# EAGLE design tongue_electrode_grid (EAGLE 7.3.0)
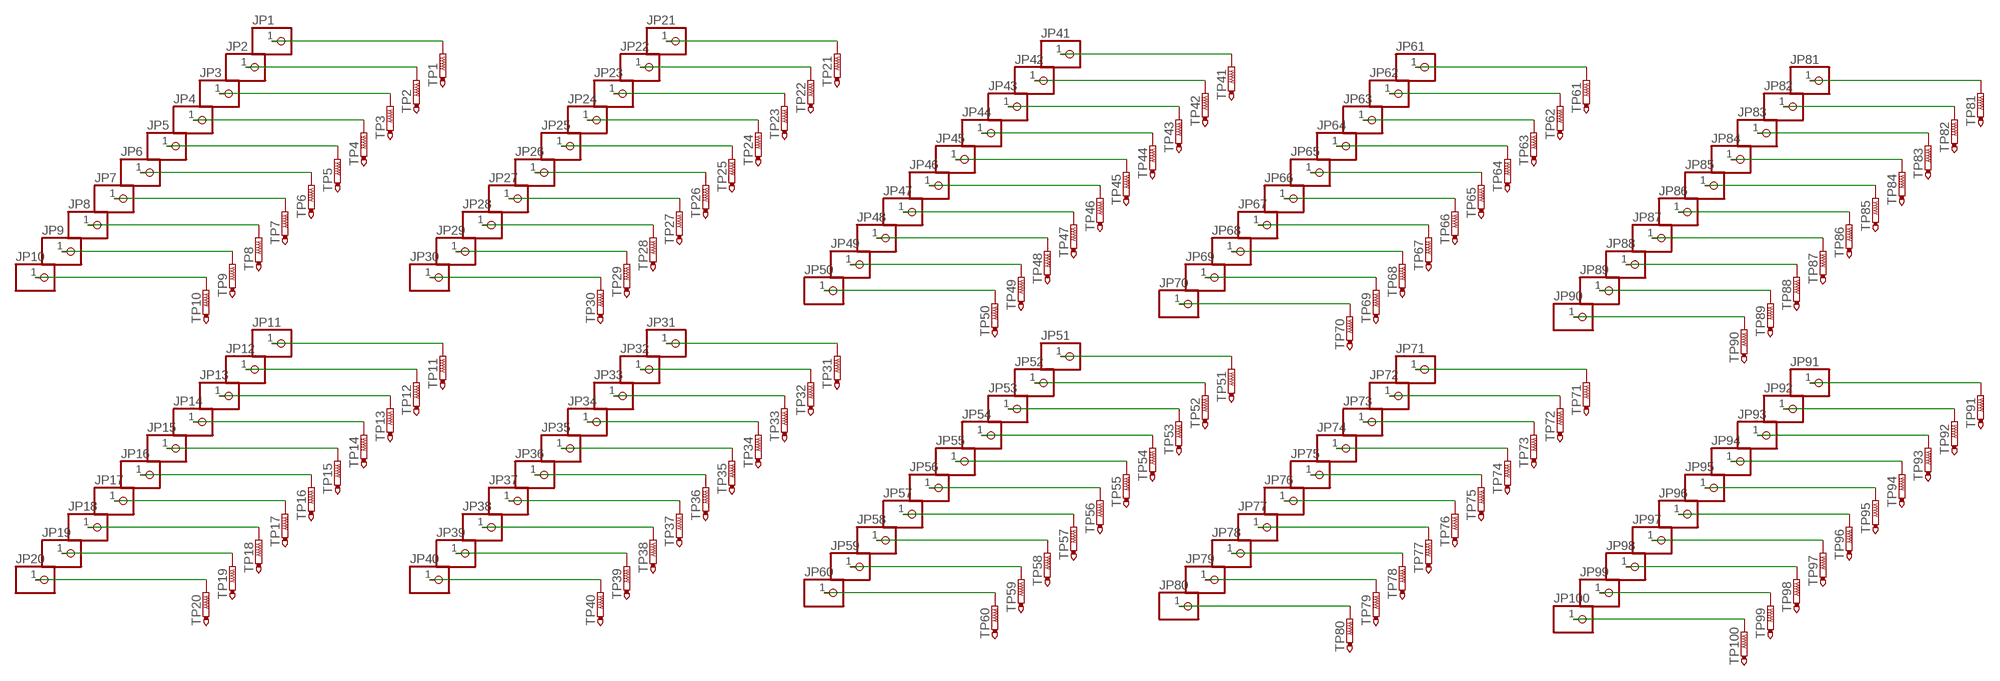
[diagram p0: schematic, sheet 1]

## Parts
JP1  PINHD-1X1  [1X01]
JP2  PINHD-1X1  [1X01]
JP3  PINHD-1X1  [1X01]
JP4  PINHD-1X1  [1X01]
JP5  PINHD-1X1  [1X01]
JP6  PINHD-1X1  [1X01]
JP7  PINHD-1X1  [1X01]
JP8  PINHD-1X1  [1X01]
JP9  PINHD-1X1  [1X01]
JP10  PINHD-1X1  [1X01]
JP11  PINHD-1X1  [1X01]
JP12  PINHD-1X1  [1X01]
JP13  PINHD-1X1  [1X01]
JP14  PINHD-1X1  [1X01]
JP15  PINHD-1X1  [1X01]
JP16  PINHD-1X1  [1X01]
JP17  PINHD-1X1  [1X01]
JP18  PINHD-1X1  [1X01]
JP19  PINHD-1X1  [1X01]
JP20  PINHD-1X1  [1X01]
JP21  PINHD-1X1  [1X01]
JP22  PINHD-1X1  [1X01]
JP23  PINHD-1X1  [1X01]
JP24  PINHD-1X1  [1X01]
JP25  PINHD-1X1  [1X01]
JP26  PINHD-1X1  [1X01]
JP27  PINHD-1X1  [1X01]
JP28  PINHD-1X1  [1X01]
JP29  PINHD-1X1  [1X01]
JP30  PINHD-1X1  [1X01]
JP31  PINHD-1X1  [1X01]
JP32  PINHD-1X1  [1X01]
JP33  PINHD-1X1  [1X01]
JP34  PINHD-1X1  [1X01]
JP35  PINHD-1X1  [1X01]
JP36  PINHD-1X1  [1X01]
JP37  PINHD-1X1  [1X01]
JP38  PINHD-1X1  [1X01]
JP39  PINHD-1X1  [1X01]
JP40  PINHD-1X1  [1X01]
JP41  PINHD-1X1  [1X01]
JP42  PINHD-1X1  [1X01]
JP43  PINHD-1X1  [1X01]
JP44  PINHD-1X1  [1X01]
JP45  PINHD-1X1  [1X01]
JP46  PINHD-1X1  [1X01]
JP47  PINHD-1X1  [1X01]
JP48  PINHD-1X1  [1X01]
JP49  PINHD-1X1  [1X01]
JP50  PINHD-1X1  [1X01]
JP51  PINHD-1X1  [1X01]
JP52  PINHD-1X1  [1X01]
JP53  PINHD-1X1  [1X01]
JP54  PINHD-1X1  [1X01]
JP55  PINHD-1X1  [1X01]
JP56  PINHD-1X1  [1X01]
JP57  PINHD-1X1  [1X01]
JP58  PINHD-1X1  [1X01]
JP59  PINHD-1X1  [1X01]
JP60  PINHD-1X1  [1X01]
JP61  PINHD-1X1  [1X01]
JP62  PINHD-1X1  [1X01]
JP63  PINHD-1X1  [1X01]
JP64  PINHD-1X1  [1X01]
JP65  PINHD-1X1  [1X01]
JP66  PINHD-1X1  [1X01]
JP67  PINHD-1X1  [1X01]
JP68  PINHD-1X1  [1X01]
JP69  PINHD-1X1  [1X01]
JP70  PINHD-1X1  [1X01]
JP71  PINHD-1X1  [1X01]
JP72  PINHD-1X1  [1X01]
JP73  PINHD-1X1  [1X01]
JP74  PINHD-1X1  [1X01]
JP75  PINHD-1X1  [1X01]
JP76  PINHD-1X1  [1X01]
JP77  PINHD-1X1  [1X01]
JP78  PINHD-1X1  [1X01]
JP79  PINHD-1X1  [1X01]
JP80  PINHD-1X1  [1X01]
JP81  PINHD-1X1  [1X01]
JP82  PINHD-1X1  [1X01]
JP83  PINHD-1X1  [1X01]
JP84  PINHD-1X1  [1X01]
JP85  PINHD-1X1  [1X01]
JP86  PINHD-1X1  [1X01]
JP87  PINHD-1X1  [1X01]
JP88  PINHD-1X1  [1X01]
JP89  PINHD-1X1  [1X01]
JP90  PINHD-1X1  [1X01]
JP91  PINHD-1X1  [1X01]
JP92  PINHD-1X1  [1X01]
JP93  PINHD-1X1  [1X01]
JP94  PINHD-1X1  [1X01]
JP95  PINHD-1X1  [1X01]
JP96  PINHD-1X1  [1X01]
JP97  PINHD-1X1  [1X01]
JP98  PINHD-1X1  [1X01]
JP99  PINHD-1X1  [1X01]
JP100  PINHD-1X1  [1X01]
TP1  PTR1TP11R  [TP11R]
TP2  PTR1TP11R  [TP11R]
TP3  PTR1TP11R  [TP11R]
TP4  PTR1TP11R  [TP11R]
TP5  PTR1TP11R  [TP11R]
TP6  PTR1TP11R  [TP11R]
TP7  PTR1TP11R  [TP11R]
TP8  PTR1TP11R  [TP11R]
TP9  PTR1TP11R  [TP11R]
TP10  PTR1TP11R  [TP11R]
TP11  PTR1TP11R  [TP11R]
TP12  PTR1TP11R  [TP11R]
TP13  PTR1TP11R  [TP11R]
TP14  PTR1TP11R  [TP11R]
TP15  PTR1TP11R  [TP11R]
TP16  PTR1TP11R  [TP11R]
TP17  PTR1TP11R  [TP11R]
TP18  PTR1TP11R  [TP11R]
TP19  PTR1TP11R  [TP11R]
TP20  PTR1TP11R  [TP11R]
TP21  PTR1TP11R  [TP11R]
TP22  PTR1TP11R  [TP11R]
TP23  PTR1TP11R  [TP11R]
TP24  PTR1TP11R  [TP11R]
TP25  PTR1TP11R  [TP11R]
TP26  PTR1TP11R  [TP11R]
TP27  PTR1TP11R  [TP11R]
TP28  PTR1TP11R  [TP11R]
TP29  PTR1TP11R  [TP11R]
TP30  PTR1TP11R  [TP11R]
TP31  PTR1TP11R  [TP11R]
TP32  PTR1TP11R  [TP11R]
TP33  PTR1TP11R  [TP11R]
TP34  PTR1TP11R  [TP11R]
TP35  PTR1TP11R  [TP11R]
TP36  PTR1TP11R  [TP11R]
TP37  PTR1TP11R  [TP11R]
TP38  PTR1TP11R  [TP11R]
TP39  PTR1TP11R  [TP11R]
TP40  PTR1TP11R  [TP11R]
TP41  PTR1TP11R  [TP11R]
TP42  PTR1TP11R  [TP11R]
TP43  PTR1TP11R  [TP11R]
TP44  PTR1TP11R  [TP11R]
TP45  PTR1TP11R  [TP11R]
TP46  PTR1TP11R  [TP11R]
TP47  PTR1TP11R  [TP11R]
TP48  PTR1TP11R  [TP11R]
TP49  PTR1TP11R  [TP11R]
TP50  PTR1TP11R  [TP11R]
TP51  PTR1TP11R  [TP11R]
TP52  PTR1TP11R  [TP11R]
TP53  PTR1TP11R  [TP11R]
TP54  PTR1TP11R  [TP11R]
TP55  PTR1TP11R  [TP11R]
TP56  PTR1TP11R  [TP11R]
TP57  PTR1TP11R  [TP11R]
TP58  PTR1TP11R  [TP11R]
TP59  PTR1TP11R  [TP11R]
TP60  PTR1TP11R  [TP11R]
TP61  PTR1TP11R  [TP11R]
TP62  PTR1TP11R  [TP11R]
TP63  PTR1TP11R  [TP11R]
TP64  PTR1TP11R  [TP11R]
TP65  PTR1TP11R  [TP11R]
TP66  PTR1TP11R  [TP11R]
TP67  PTR1TP11R  [TP11R]
TP68  PTR1TP11R  [TP11R]
TP69  PTR1TP11R  [TP11R]
TP70  PTR1TP11R  [TP11R]
TP71  PTR1TP11R  [TP11R]
TP72  PTR1TP11R  [TP11R]
TP73  PTR1TP11R  [TP11R]
TP74  PTR1TP11R  [TP11R]
TP75  PTR1TP11R  [TP11R]
TP76  PTR1TP11R  [TP11R]
TP77  PTR1TP11R  [TP11R]
TP78  PTR1TP11R  [TP11R]
TP79  PTR1TP11R  [TP11R]
TP80  PTR1TP11R  [TP11R]
TP81  PTR1TP11R  [TP11R]
TP82  PTR1TP11R  [TP11R]
TP83  PTR1TP11R  [TP11R]
TP84  PTR1TP11R  [TP11R]
TP85  PTR1TP11R  [TP11R]
TP86  PTR1TP11R  [TP11R]
TP87  PTR1TP11R  [TP11R]
TP88  PTR1TP11R  [TP11R]
TP89  PTR1TP11R  [TP11R]
TP90  PTR1TP11R  [TP11R]
TP91  PTR1TP11R  [TP11R]
TP92  PTR1TP11R  [TP11R]
TP93  PTR1TP11R  [TP11R]
TP94  PTR1TP11R  [TP11R]
TP95  PTR1TP11R  [TP11R]
TP96  PTR1TP11R  [TP11R]
TP97  PTR1TP11R  [TP11R]
TP98  PTR1TP11R  [TP11R]
TP99  PTR1TP11R  [TP11R]
TP100  PTR1TP11R  [TP11R]

## Nets
N$1: JP1.1 TP1.TP
N$2: JP2.1 TP2.TP
N$3: JP3.1 TP3.TP
N$4: JP4.1 TP4.TP
N$5: JP5.1 TP5.TP
N$6: JP6.1 TP6.TP
N$7: JP7.1 TP7.TP
N$8: JP8.1 TP8.TP
N$9: JP9.1 TP9.TP
N$10: JP10.1 TP10.TP
N$11: JP11.1 TP11.TP
N$12: JP12.1 TP12.TP
N$13: JP13.1 TP13.TP
N$14: JP14.1 TP14.TP
N$15: JP15.1 TP15.TP
N$16: JP16.1 TP16.TP
N$17: JP17.1 TP17.TP
N$18: JP18.1 TP18.TP
N$19: JP19.1 TP19.TP
N$20: JP20.1 TP20.TP
N$21: JP21.1 TP21.TP
N$23: JP22.1 TP22.TP
N$24: JP23.1 TP23.TP
N$25: JP24.1 TP24.TP
N$26: JP25.1 TP25.TP
N$27: JP26.1 TP26.TP
N$28: JP27.1 TP27.TP
N$29: JP28.1 TP28.TP
N$30: JP29.1 TP29.TP
N$31: JP30.1 TP30.TP
N$32: JP31.1 TP31.TP
N$33: JP32.1 TP32.TP
N$34: JP33.1 TP33.TP
N$35: JP34.1 TP34.TP
N$36: JP35.1 TP35.TP
N$37: JP36.1 TP36.TP
N$38: JP37.1 TP37.TP
N$39: JP38.1 TP38.TP
N$40: JP39.1 TP39.TP
N$41: JP40.1 TP40.TP
N$42: JP41.1 TP41.TP
N$43: JP42.1 TP42.TP
N$44: JP43.1 TP43.TP
N$45: JP44.1 TP44.TP
N$46: JP45.1 TP45.TP
N$47: JP46.1 TP46.TP
N$48: JP47.1 TP47.TP
N$49: JP48.1 TP48.TP
N$50: JP49.1 TP49.TP
N$51: JP50.1 TP50.TP
N$52: JP51.1 TP51.TP
N$53: JP52.1 TP52.TP
N$54: JP53.1 TP53.TP
N$55: JP54.1 TP54.TP
N$56: JP55.1 TP55.TP
N$57: JP56.1 TP56.TP
N$58: JP57.1 TP57.TP
N$59: JP58.1 TP58.TP
N$60: JP59.1 TP59.TP
N$61: JP60.1 TP60.TP
N$62: JP61.1 TP61.TP
N$63: JP62.1 TP62.TP
N$64: JP63.1 TP63.TP
N$65: JP64.1 TP64.TP
N$66: JP65.1 TP65.TP
N$67: JP66.1 TP66.TP
N$68: JP67.1 TP67.TP
N$69: JP68.1 TP68.TP
N$70: JP69.1 TP69.TP
N$71: JP70.1 TP70.TP
N$72: JP71.1 TP71.TP
N$73: JP72.1 TP72.TP
N$74: JP73.1 TP73.TP
N$75: JP74.1 TP74.TP
N$76: JP75.1 TP75.TP
N$77: JP76.1 TP76.TP
N$78: JP77.1 TP77.TP
N$79: JP78.1 TP78.TP
N$80: JP79.1 TP79.TP
N$81: JP80.1 TP80.TP
N$82: JP81.1 TP81.TP
N$83: JP82.1 TP82.TP
N$84: JP83.1 TP83.TP
N$85: JP84.1 TP84.TP
N$86: JP85.1 TP85.TP
N$87: JP86.1 TP86.TP
N$88: JP87.1 TP87.TP
N$89: JP88.1 TP88.TP
N$90: JP89.1 TP89.TP
N$91: JP90.1 TP90.TP
N$92: JP91.1 TP91.TP
N$93: JP92.1 TP92.TP
N$94: JP93.1 TP93.TP
N$95: JP94.1 TP94.TP
N$96: JP95.1 TP95.TP
N$97: JP96.1 TP96.TP
N$98: JP97.1 TP97.TP
N$99: JP98.1 TP98.TP
N$100: JP99.1 TP99.TP
N$101: JP100.1 TP100.TP

## Library data of the parts
JP1-JP100 = pinhead:PINHD-1X1: PIN HEADER
TP1-TP100 = testpad:PTR1: TEST PIN

## Board
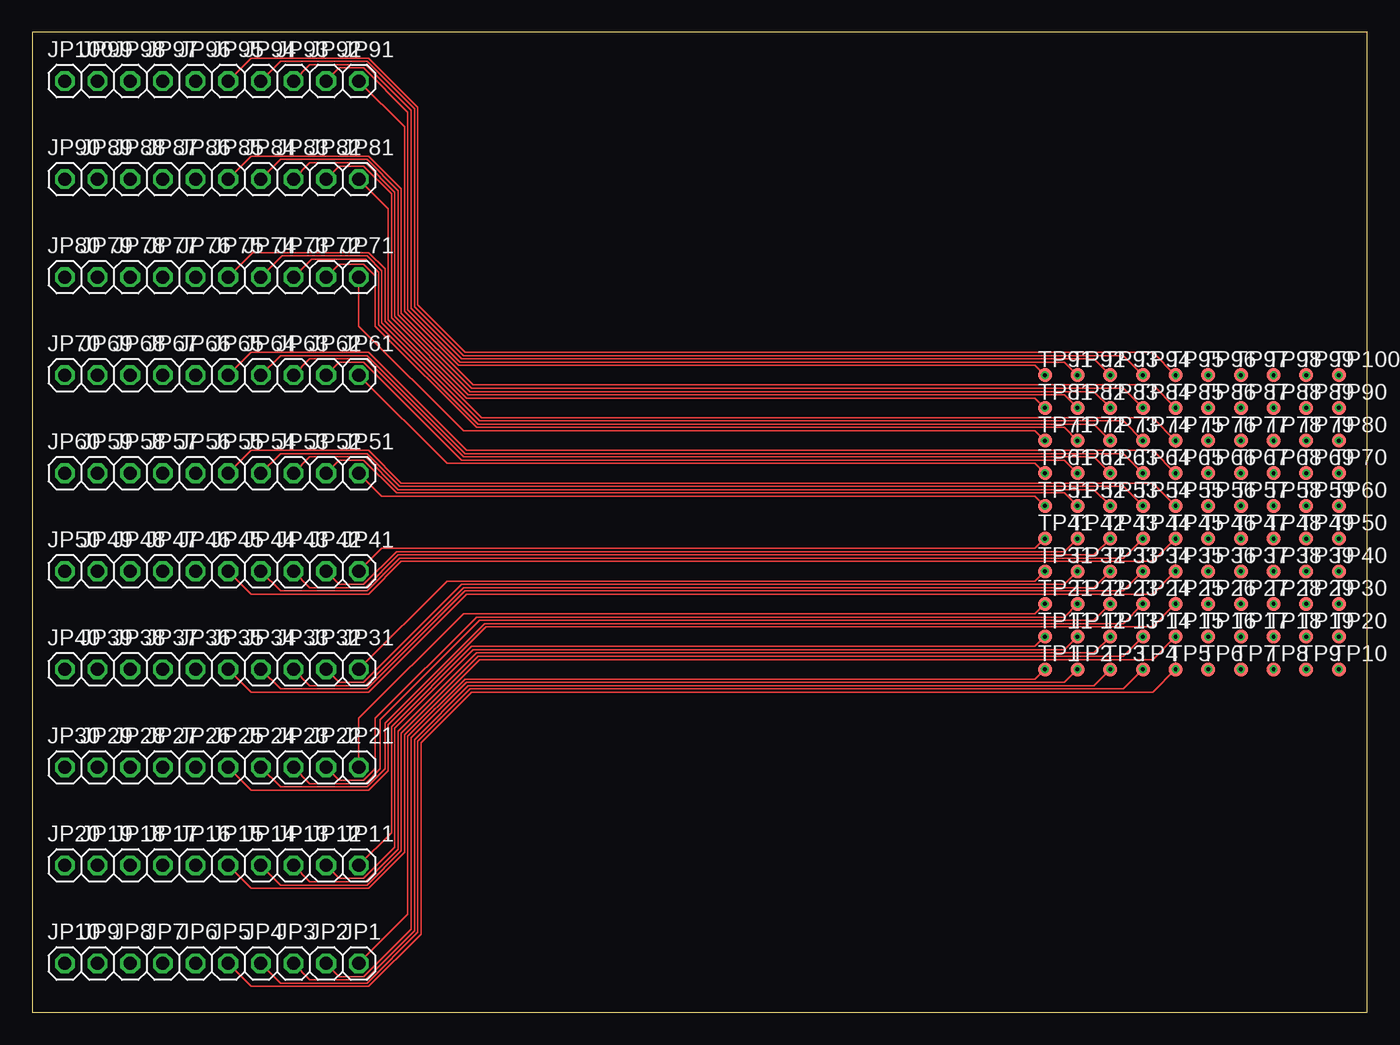
[diagram p1: board, top side]
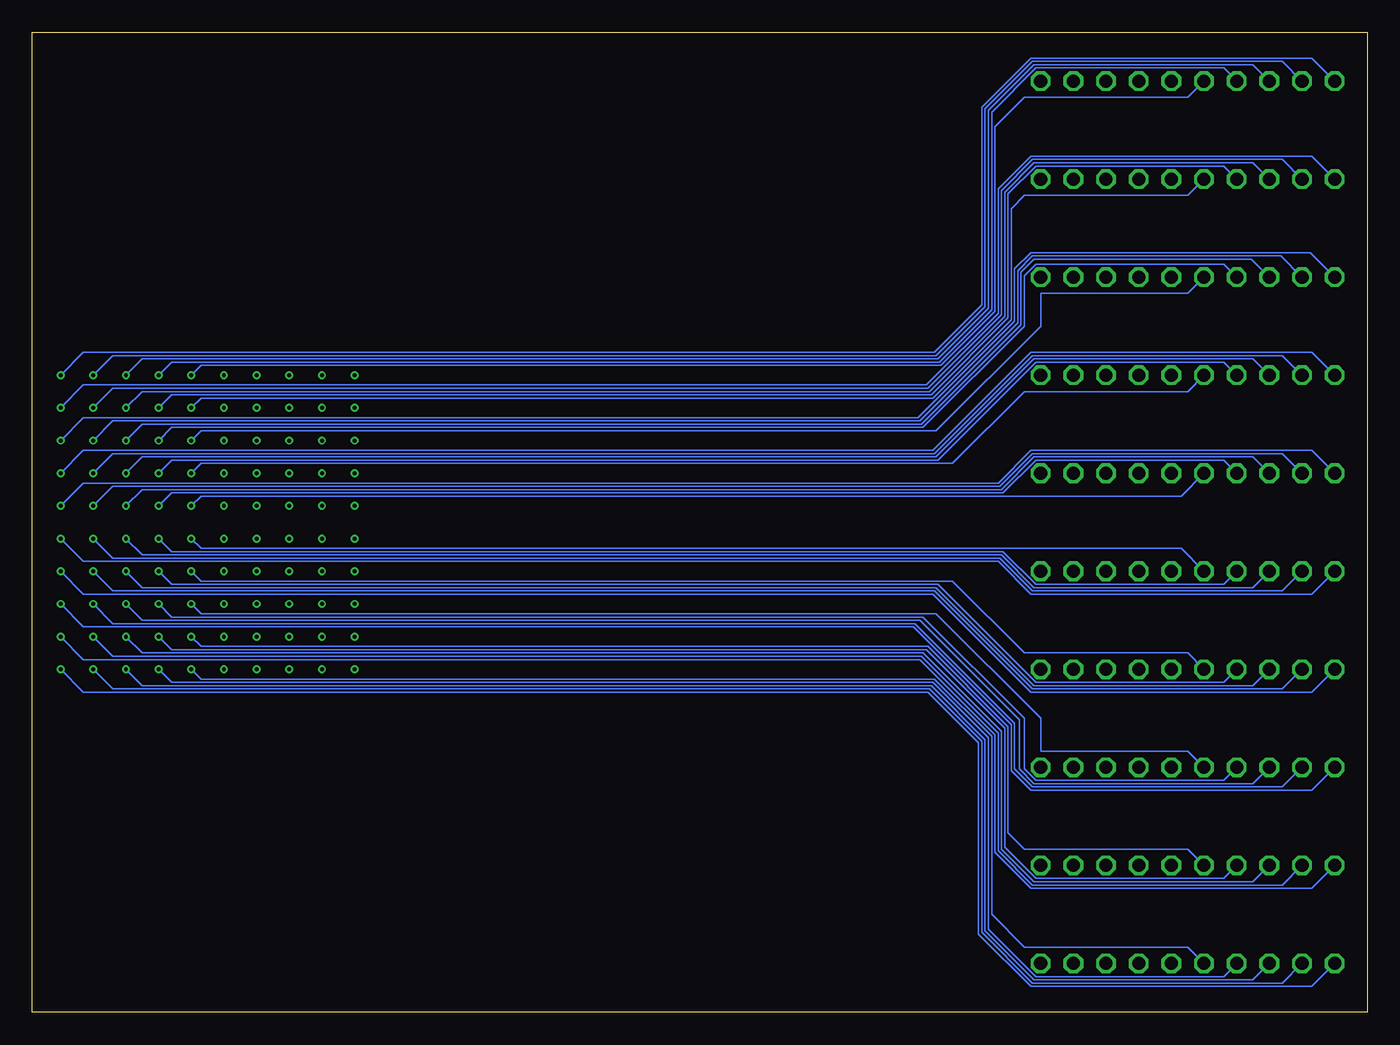
[diagram p2: board, bottom side, seen from below]

Size 103.81 x 76.19 mm. Coordinates in mm from the lower left corner, seen from the top.
Outline: 0,0 103.81,0 103.81,76.19 0,76.19 0,0
Copper layers (1*16): Top 0.035mm / dielectric 1.5mm / Bottom 0.035mm
Design rules "5mil_SeeedStudio_2layer_DRU_no_angle_20140221": minimum track width 5mil, minimum drill 12mil, track to track 5mil, track to pad 5mil, pad to pad 5mil, via to via 5mil, smd to smd 0mil, copper to edge 10mil, drill to drill 10mil, minimum pad ring 10mil, minimum via ring 6mil, stop-mask expansion 2mil, vias tented up to drill 100mil, thermal gap 10mil

### Footprints (pad centres in the part's own frame; a part is rotated, then mirrored left to right if it is on the bottom)
1X01 = drill 1.016 octagon: 1 0,0
TP11R = smd 1.1 x 1.1: TP 0,0

### Placement (x,y rotation side)
JP1  25.4,3.81 0 top
JP2  22.86,3.81 0 top
JP3  20.32,3.81 0 top
JP4  17.78,3.81 0 top
JP5  15.24,3.81 0 top
JP6  12.7,3.81 0 top
JP7  10.16,3.81 0 top
JP8  7.62,3.81 0 top
JP9  5.08,3.81 0 top
JP10  2.54,3.81 0 top
JP11  25.4,11.43 0 top
JP12  22.86,11.43 0 top
JP13  20.32,11.43 0 top
JP14  17.78,11.43 0 top
JP15  15.24,11.43 0 top
JP16  12.7,11.43 0 top
JP17  10.16,11.43 0 top
JP18  7.62,11.43 0 top
JP19  5.08,11.43 0 top
JP20  2.54,11.43 0 top
JP21  25.4,19.05 0 top
JP22  22.86,19.05 0 top
JP23  20.32,19.05 0 top
JP24  17.78,19.05 0 top
JP25  15.24,19.05 0 top
JP26  12.7,19.05 0 top
JP27  10.16,19.05 0 top
JP28  7.62,19.05 0 top
JP29  5.08,19.05 0 top
JP30  2.54,19.05 0 top
JP31  25.4,26.67 0 top
JP32  22.86,26.67 0 top
JP33  20.32,26.67 0 top
JP34  17.78,26.67 0 top
JP35  15.24,26.67 0 top
JP36  12.7,26.67 0 top
JP37  10.16,26.67 0 top
JP38  7.62,26.67 0 top
JP39  5.08,26.67 0 top
JP40  2.54,26.67 0 top
JP41  25.4,34.29 0 top
JP42  22.86,34.29 0 top
JP43  20.32,34.29 0 top
JP44  17.78,34.29 0 top
JP45  15.24,34.29 0 top
JP46  12.7,34.29 0 top
JP47  10.16,34.29 0 top
JP48  7.62,34.29 0 top
JP49  5.08,34.29 0 top
JP50  2.54,34.29 0 top
JP51  25.4,41.91 0 top
JP52  22.86,41.91 0 top
JP53  20.32,41.91 0 top
JP54  17.78,41.91 0 top
JP55  15.24,41.91 0 top
JP56  12.7,41.91 0 top
JP57  10.16,41.91 0 top
JP58  7.62,41.91 0 top
JP59  5.08,41.91 0 top
JP60  2.54,41.91 0 top
JP61  25.4,49.53 0 top
JP62  22.86,49.53 0 top
JP63  20.32,49.53 0 top
JP64  17.78,49.53 0 top
JP65  15.24,49.53 0 top
JP66  12.7,49.53 0 top
JP67  10.16,49.53 0 top
JP68  7.62,49.53 0 top
JP69  5.08,49.53 0 top
JP70  2.54,49.53 0 top
JP71  25.4,57.15 0 top
JP72  22.86,57.15 0 top
JP73  20.32,57.15 0 top
JP74  17.78,57.15 0 top
JP75  15.24,57.15 0 top
JP76  12.7,57.15 0 top
JP77  10.16,57.15 0 top
JP78  7.62,57.15 0 top
JP79  5.08,57.15 0 top
JP80  2.54,57.15 0 top
JP81  25.4,64.77 0 top
JP82  22.86,64.77 0 top
JP83  20.32,64.77 0 top
JP84  17.78,64.77 0 top
JP85  15.24,64.77 0 top
JP86  12.7,64.77 0 top
JP87  10.16,64.77 0 top
JP88  7.62,64.77 0 top
JP89  5.08,64.77 0 top
JP90  2.54,64.77 0 top
JP91  25.4,72.39 0 top
JP92  22.86,72.39 0 top
JP93  20.32,72.39 0 top
JP94  17.78,72.39 0 top
JP95  15.24,72.39 0 top
JP96  12.7,72.39 0 top
JP97  10.16,72.39 0 top
JP98  7.62,72.39 0 top
JP99  5.08,72.39 0 top
JP100  2.54,72.39 0 top
TP1  78.74,26.67 0 top
TP2  81.28,26.67 0 top
TP3  83.82,26.67 0 top
TP4  86.36,26.67 0 top
TP5  88.9,26.67 0 top
TP6  91.44,26.67 0 top
TP7  93.98,26.67 0 top
TP8  96.52,26.67 0 top
TP9  99.06,26.67 0 top
TP10  101.6,26.67 0 top
TP11  78.74,29.21 0 top
TP12  81.28,29.21 0 top
TP13  83.82,29.21 0 top
TP14  86.36,29.21 0 top
TP15  88.9,29.21 0 top
TP16  91.44,29.21 0 top
TP17  93.98,29.21 0 top
TP18  96.52,29.21 0 top
TP19  99.06,29.21 0 top
TP20  101.6,29.21 0 top
TP21  78.74,31.75 0 top
TP22  81.28,31.75 0 top
TP23  83.82,31.75 0 top
TP24  86.36,31.75 0 top
TP25  88.9,31.75 0 top
TP26  91.44,31.75 0 top
TP27  93.98,31.75 0 top
TP28  96.52,31.75 0 top
TP29  99.06,31.75 0 top
TP30  101.6,31.75 0 top
TP31  78.74,34.29 0 top
TP32  81.28,34.29 0 top
TP33  83.82,34.29 0 top
TP34  86.36,34.29 0 top
TP35  88.9,34.29 0 top
TP36  91.44,34.29 0 top
TP37  93.98,34.29 0 top
TP38  96.52,34.29 0 top
TP39  99.06,34.29 0 top
TP40  101.6,34.29 0 top
TP41  78.74,36.83 0 top
TP42  81.28,36.83 0 top
TP43  83.82,36.83 0 top
TP44  86.36,36.83 0 top
TP45  88.9,36.83 0 top
TP46  91.44,36.83 0 top
TP47  93.98,36.83 0 top
TP48  96.52,36.83 0 top
TP49  99.06,36.83 0 top
TP50  101.6,36.83 0 top
TP51  78.74,39.37 0 top
TP52  81.28,39.37 0 top
TP53  83.82,39.37 0 top
TP54  86.36,39.37 0 top
TP55  88.9,39.37 0 top
TP56  91.44,39.37 0 top
TP57  93.98,39.37 0 top
TP58  96.52,39.37 0 top
TP59  99.06,39.37 0 top
TP60  101.6,39.37 0 top
TP61  78.74,41.91 0 top
TP62  81.28,41.91 0 top
TP63  83.82,41.91 0 top
TP64  86.36,41.91 0 top
TP65  88.9,41.91 0 top
TP66  91.44,41.91 0 top
TP67  93.98,41.91 0 top
TP68  96.52,41.91 0 top
TP69  99.06,41.91 0 top
TP70  101.6,41.91 0 top
TP71  78.74,44.45 0 top
TP72  81.28,44.45 0 top
TP73  83.82,44.45 0 top
TP74  86.36,44.45 0 top
TP75  88.9,44.45 0 top
TP76  91.44,44.45 0 top
TP77  93.98,44.45 0 top
TP78  96.52,44.45 0 top
TP79  99.06,44.45 0 top
TP80  101.6,44.45 0 top
TP81  78.74,46.99 0 top
TP82  81.28,46.99 0 top
TP83  83.82,46.99 0 top
TP84  86.36,46.99 0 top
TP85  88.9,46.99 0 top
TP86  91.44,46.99 0 top
TP87  93.98,46.99 0 top
TP88  96.52,46.99 0 top
TP89  99.06,46.99 0 top
TP90  101.6,46.99 0 top
TP91  78.74,49.53 0 top
TP92  81.28,49.53 0 top
TP93  83.82,49.53 0 top
TP94  86.36,49.53 0 top
TP95  88.9,49.53 0 top
TP96  91.44,49.53 0 top
TP97  93.98,49.53 0 top
TP98  96.52,49.53 0 top
TP99  99.06,49.53 0 top
TP100  101.6,49.53 0 top

### Tracks (layer width: path | path; a pad name or v marks a point on that pad's centre or on a via)
N$1  (via drill 0.3)
  Top 0.127: TP1.TP 77.98,25.91 33.66,25.91 29.21,21.46 29.21,7.62 JP1.1
  other vias: 78.74,26.67
N$2  (via drill 0.3)
  Top 0.127: TP2.TP 80.26,25.65 33.78,25.65 29.46,21.34 29.46,6.48 25.78,2.79 23.88,2.79 JP2.1
  other vias: 81.28,26.67
N$3  (via drill 0.3)
  Top 0.127: TP3.TP 82.55,25.4 33.91,25.4 29.72,21.21 29.72,6.35 25.91,2.54 21.59,2.54 JP3.1
  other vias: 83.82,26.67
N$4  (via drill 0.3)
  Top 0.127: TP4.TP 84.84,25.15 34.04,25.15 29.97,21.08 29.97,6.22 26.04,2.29 19.3,2.29 JP4.1
  other vias: 86.36,26.67
N$5  (via drill 0.3)
  Top 0.127: TP5.TP 87.12,24.89 34.16,24.89 30.23,20.95 30.23,6.1 26.16,2.03 17.02,2.03 JP5.1
  other vias: 88.9,26.67
N$6  (via drill 0.3)
  Bottom 0.127: TP6.TP 90.68,25.91 33.66,25.91 29.21,21.46 29.21,7.62 26.67,5.08 13.97,5.08 JP6.1
  other vias: 91.44,26.67
N$7  (via drill 0.3)
  Bottom 0.127: TP7.TP 92.96,25.65 33.78,25.65 29.46,21.34 29.46,6.48 25.78,2.79 11.18,2.79 JP7.1
  other vias: 93.98,26.67
N$8  (via drill 0.3)
  Bottom 0.127: TP8.TP 95.25,25.4 33.91,25.4 29.72,21.21 29.72,6.35 25.91,2.54 8.89,2.54 JP8.1
  other vias: 96.52,26.67
N$9  (via drill 0.3)
  Bottom 0.127: TP9.TP 97.54,25.15 34.04,25.15 29.97,21.08 29.97,6.22 26.04,2.29 6.6,2.29 JP9.1
  other vias: 99.06,26.67
N$10  (via drill 0.3)
  Bottom 0.127: TP10.TP 99.82,24.89 34.16,24.89 30.23,20.95 30.23,6.1 26.16,2.03 4.32,2.03 JP10.1
  other vias: 101.6,26.67
N$11  (via drill 0.3)
  Top 0.127: TP11.TP 77.98,28.45 34.16,28.45 27.94,22.22 27.94,13.97 JP11.1
  other vias: 78.74,29.21
N$12  (via drill 0.3)
  Top 0.127: TP12.TP 80.26,28.19 34.29,28.19 28.19,22.1 28.19,12.83 25.78,10.41 23.88,10.41 JP12.1
  other vias: 81.28,29.21
N$13  (via drill 0.3)
  Top 0.127: TP13.TP 82.55,27.94 34.54,27.94 28.45,21.84 28.45,12.7 25.91,10.16 21.59,10.16 JP13.1
  other vias: 83.82,29.21
N$14  (via drill 0.3)
  Top 0.127: TP14.TP 84.84,27.69 34.67,27.69 28.7,21.72 28.7,12.57 26.04,9.91 19.3,9.91 JP14.1
  other vias: 86.36,29.21
N$15  (via drill 0.3)
  Top 0.127: TP15.TP 87.12,27.43 34.8,27.43 28.96,21.59 28.96,12.45 26.16,9.65 17.02,9.65 JP15.1
  other vias: 88.9,29.21
N$16  (via drill 0.3)
  Bottom 0.127: TP16.TP 90.68,28.45 34.16,28.45 27.94,22.22 27.94,13.97 26.67,12.7 13.97,12.7 JP16.1
  other vias: 91.44,29.21
N$17  (via drill 0.3)
  Bottom 0.127: TP17.TP 92.96,28.19 34.29,28.19 28.19,22.1 28.19,12.83 25.78,10.41 11.18,10.41 JP17.1
  other vias: 93.98,29.21
N$18  (via drill 0.3)
  Bottom 0.127: TP18.TP 95.25,27.94 34.54,27.94 28.45,21.84 28.45,12.7 25.91,10.16 8.89,10.16 JP18.1
  other vias: 96.52,29.21
N$19  (via drill 0.3)
  Bottom 0.127: TP19.TP 97.54,27.69 34.67,27.69 28.7,21.72 28.7,12.57 26.04,9.91 6.6,9.91 JP19.1
  other vias: 99.06,29.21
N$20  (via drill 0.3)
  Bottom 0.127: TP20.TP 99.82,27.43 34.8,27.43 28.96,21.59 28.96,12.45 26.16,9.65 4.32,9.65 JP20.1
  other vias: 101.6,29.21
N$21  (via drill 0.3)
  Top 0.127: TP21.TP 77.98,30.99 33.53,30.99 25.4,22.86 JP21.1
  other vias: 78.74,31.75
N$23  (via drill 0.3)
  Top 0.127: TP22.TP 80.26,30.73 34.54,30.73 26.67,22.86 26.67,18.92 25.78,18.03 23.88,18.03 JP22.1
  other vias: 81.28,31.75
N$24  (via drill 0.3)
  Top 0.127: TP23.TP 82.55,30.48 34.8,30.48 27.05,22.73 27.05,18.92 25.91,17.78 21.59,17.78 JP23.1
  other vias: 83.82,31.75
N$25  (via drill 0.3)
  Top 0.127: TP24.TP 84.84,30.23 35.18,30.23 27.43,22.48 27.43,18.92 26.04,17.53 19.3,17.53 JP24.1
  other vias: 86.36,31.75
N$26  (via drill 0.3)
  Top 0.127: TP25.TP 87.12,29.97 35.31,29.97 27.69,22.35 27.69,18.8 26.16,17.27 17.02,17.27 JP25.1
  other vias: 88.9,31.75
N$27  (via drill 0.3)
  Bottom 0.127: TP26.TP 90.68,30.99 33.53,30.99 25.4,22.86 25.4,20.32 13.97,20.32 JP26.1
  other vias: 91.44,31.75
N$28  (via drill 0.3)
  Bottom 0.127: TP27.TP 92.96,30.73 34.54,30.73 26.67,22.86 26.67,18.92 25.78,18.03 11.18,18.03 JP27.1
  other vias: 93.98,31.75
N$29  (via drill 0.3)
  Bottom 0.127: TP28.TP 95.25,30.48 34.8,30.48 27.05,22.73 27.05,18.92 25.91,17.78 8.89,17.78 JP28.1
  other vias: 96.52,31.75
N$30  (via drill 0.3)
  Bottom 0.127: TP29.TP 97.54,30.23 35.18,30.23 27.43,22.48 27.43,18.92 26.04,17.53 6.6,17.53 JP29.1
  other vias: 99.06,31.75
N$31  (via drill 0.3)
  Bottom 0.127: TP30.TP 99.82,29.97 35.31,29.97 27.69,22.35 27.69,18.8 26.16,17.27 4.32,17.27 JP30.1
  other vias: 101.6,31.75
N$32  (via drill 0.3)
  Top 0.127: TP31.TP 77.98,33.53 32.26,33.53 JP31.1
  other vias: 78.74,34.29
N$33  (via drill 0.3)
  Top 0.127: TP32.TP 80.26,33.27 33.4,33.27 25.78,25.65 23.88,25.65 JP32.1
  other vias: 81.28,34.29
N$34  (via drill 0.3)
  Top 0.127: TP33.TP 82.55,33.02 33.53,33.02 25.91,25.4 21.59,25.4 JP33.1
  other vias: 83.82,34.29
N$35  (via drill 0.3)
  Top 0.127: TP34.TP 84.84,32.77 33.66,32.77 26.04,25.15 19.3,25.15 JP34.1
  other vias: 86.36,34.29
N$36  (via drill 0.3)
  Top 0.127: TP35.TP 87.12,32.51 33.78,32.51 26.16,24.89 17.02,24.89 JP35.1
  other vias: 88.9,34.29
N$37  (via drill 0.3)
  Bottom 0.127: TP36.TP 90.68,33.53 32.26,33.53 26.67,27.94 13.97,27.94 JP36.1
  other vias: 91.44,34.29
N$38  (via drill 0.3)
  Bottom 0.127: TP37.TP 92.96,33.27 33.4,33.27 25.78,25.65 11.18,25.65 JP37.1
  other vias: 93.98,34.29
N$39  (via drill 0.3)
  Bottom 0.127: TP38.TP 95.25,33.02 33.53,33.02 25.91,25.4 8.89,25.4 JP38.1
  other vias: 96.52,34.29
N$40  (via drill 0.3)
  Bottom 0.127: TP39.TP 97.54,32.77 33.66,32.77 26.04,25.15 6.6,25.15 JP39.1
  other vias: 99.06,34.29
N$41  (via drill 0.3)
  Bottom 0.127: TP40.TP 99.82,32.51 33.78,32.51 26.16,24.89 4.32,24.89 JP40.1
  other vias: 101.6,34.29
N$42  (via drill 0.3)
  Top 0.127: TP41.TP 77.98,36.07 27.18,36.07 JP41.1
  other vias: 78.74,36.83
N$43  (via drill 0.3)
  Top 0.127: TP42.TP 80.26,35.81 28.32,35.81 25.78,33.27 23.88,33.27 JP42.1
  other vias: 81.28,36.83
N$44  (via drill 0.3)
  Top 0.127: TP43.TP 82.55,35.56 28.45,35.56 25.91,33.02 21.59,33.02 JP43.1
  other vias: 83.82,36.83
N$45  (via drill 0.3)
  Top 0.127: TP44.TP 84.84,35.31 28.57,35.31 26.04,32.77 19.3,32.77 JP44.1
  other vias: 86.36,36.83
N$46  (via drill 0.3)
  Top 0.127: TP45.TP 87.12,35.05 28.7,35.05 26.16,32.51 17.02,32.51 JP45.1
  other vias: 88.9,36.83
N$47  (via drill 0.3)
  Bottom 0.127: TP46.TP 90.68,36.07 14.48,36.07 JP46.1
  other vias: 91.44,36.83
N$48  (via drill 0.3)
  Bottom 0.127: TP47.TP 92.96,35.81 28.32,35.81 25.78,33.27 11.18,33.27 JP47.1
  other vias: 93.98,36.83
N$49  (via drill 0.3)
  Bottom 0.127: TP48.TP 95.25,35.56 28.45,35.56 25.91,33.02 8.89,33.02 JP48.1
  other vias: 96.52,36.83
N$50  (via drill 0.3)
  Bottom 0.127: TP49.TP 97.54,35.31 28.57,35.31 26.04,32.77 6.6,32.77 JP49.1
  other vias: 99.06,36.83
N$51  (via drill 0.3)
  Bottom 0.127: TP50.TP 99.82,35.05 28.7,35.05 26.16,32.51 4.32,32.51 JP50.1
  other vias: 101.6,36.83
N$52  (via drill 0.3)
  Top 0.127: TP51.TP 77.98,40.13 27.18,40.13 JP51.1
  other vias: 78.74,39.37
N$53  (via drill 0.3)
  Top 0.127: TP52.TP 80.26,40.39 28.32,40.39 25.78,42.93 23.88,42.93 JP52.1
  other vias: 81.28,39.37
N$54  (via drill 0.3)
  Top 0.127: TP53.TP 82.55,40.64 28.45,40.64 25.91,43.18 21.59,43.18 JP53.1
  other vias: 83.82,39.37
N$55  (via drill 0.3)
  Top 0.127: TP54.TP 84.84,40.89 28.57,40.89 26.04,43.43 19.3,43.43 JP54.1
  other vias: 86.36,39.37
N$56  (via drill 0.3)
  Top 0.127: TP55.TP 87.12,41.15 28.7,41.15 26.16,43.69 17.02,43.69 JP55.1
  other vias: 88.9,39.37
N$57  (via drill 0.3)
  Bottom 0.127: TP56.TP 90.68,40.13 14.48,40.13 JP56.1
  other vias: 91.44,39.37
N$58  (via drill 0.3)
  Bottom 0.127: TP57.TP 92.96,40.39 28.32,40.39 25.78,42.93 11.18,42.93 JP57.1
  other vias: 93.98,39.37
N$59  (via drill 0.3)
  Bottom 0.127: TP58.TP 95.25,40.64 28.45,40.64 25.91,43.18 8.89,43.18 JP58.1
  other vias: 96.52,39.37
N$60  (via drill 0.3)
  Bottom 0.127: TP59.TP 97.54,40.89 28.57,40.89 26.04,43.43 6.6,43.43 JP59.1
  other vias: 99.06,39.37
N$61  (via drill 0.3)
  Bottom 0.127: TP60.TP 99.82,41.15 28.7,41.15 26.16,43.69 4.32,43.69 JP60.1
  other vias: 101.6,39.37
N$62  (via drill 0.3)
  Top 0.127: TP61.TP 77.98,42.67 32.26,42.67 JP61.1
  other vias: 78.74,41.91
N$63  (via drill 0.3)
  Top 0.127: TP62.TP 80.26,42.93 33.4,42.93 25.78,50.55 23.88,50.55 JP62.1
  other vias: 81.28,41.91
N$64  (via drill 0.3)
  Top 0.127: TP63.TP 82.55,43.18 33.53,43.18 25.91,50.8 21.59,50.8 JP63.1
  other vias: 83.82,41.91
N$65  (via drill 0.3)
  Top 0.127: TP64.TP 84.84,43.43 33.66,43.43 26.04,51.05 19.3,51.05 JP64.1
  other vias: 86.36,41.91
N$66  (via drill 0.3)
  Top 0.127: TP65.TP 87.12,43.69 33.78,43.69 26.16,51.31 17.02,51.31 JP65.1
  other vias: 88.9,41.91
N$67  (via drill 0.3)
  Bottom 0.127: TP66.TP 90.68,42.67 32.26,42.67 26.67,48.26 13.97,48.26 JP66.1
  other vias: 91.44,41.91
N$68  (via drill 0.3)
  Bottom 0.127: TP67.TP 92.96,42.93 33.4,42.93 25.78,50.55 11.18,50.55 JP67.1
  other vias: 93.98,41.91
N$69  (via drill 0.3)
  Bottom 0.127: TP68.TP 95.25,43.18 33.53,43.18 25.91,50.8 8.89,50.8 JP68.1
  other vias: 96.52,41.91
N$70  (via drill 0.3)
  Bottom 0.127: TP69.TP 97.54,43.43 33.66,43.43 26.04,51.05 6.6,51.05 JP69.1
  other vias: 99.06,41.91
N$71  (via drill 0.3)
  Bottom 0.127: TP70.TP 99.82,43.69 33.78,43.69 26.16,51.31 4.32,51.31 JP70.1
  other vias: 101.6,41.91
N$72  (via drill 0.3)
  Top 0.127: TP71.TP 77.98,45.21 33.53,45.21 25.4,53.34 JP71.1
  other vias: 78.74,44.45
N$73  (via drill 0.3)
  Top 0.127: TP72.TP 80.26,45.47 34.54,45.47 26.67,53.34 26.67,57.28 25.78,58.17 23.88,58.17 JP72.1
  other vias: 81.28,44.45
N$74  (via drill 0.3)
  Top 0.127: TP73.TP 82.55,45.72 34.67,45.72 26.92,53.47 26.92,57.53 25.91,58.55 21.72,58.55 JP73.1
  other vias: 83.82,44.45
N$75  (via drill 0.3)
  Top 0.127: TP74.TP 84.84,45.97 34.8,45.97 27.18,53.59 27.18,57.66 26.04,58.8 19.43,58.8 JP74.1
  other vias: 86.36,44.45
N$76  (via drill 0.3)
  Top 0.127: TP75.TP 87.12,46.23 34.93,46.23 27.43,53.72 27.43,57.79 26.16,59.05 17.14,59.05 JP75.1
  other vias: 88.9,44.45
N$77  (via drill 0.3)
  Bottom 0.127: TP76.TP 90.68,45.21 33.53,45.21 25.4,53.34 25.4,55.88 13.97,55.88 JP76.1
  other vias: 91.44,44.45
N$78  (via drill 0.3)
  Bottom 0.127: TP77.TP 92.96,45.47 34.54,45.47 26.67,53.34 26.67,57.28 25.78,58.17 11.18,58.17 JP77.1
  other vias: 93.98,44.45
N$79  (via drill 0.3)
  Bottom 0.127: TP78.TP 95.25,45.72 34.67,45.72 26.92,53.47 26.92,57.53 25.91,58.55 9.02,58.55 JP78.1
  other vias: 96.52,44.45
N$80  (via drill 0.3)
  Bottom 0.127: TP79.TP 97.54,45.97 34.8,45.97 27.18,53.59 27.18,57.66 26.04,58.8 6.73,58.8 JP79.1
  other vias: 99.06,44.45
N$81  (via drill 0.3)
  Bottom 0.127: TP80.TP 99.82,46.23 34.93,46.23 27.43,53.72 27.43,57.79 26.16,59.05 4.45,59.05 JP80.1
  other vias: 101.6,44.45
N$82  (via drill 0.3)
  Top 0.127: TP81.TP 77.98,47.75 33.78,47.75 27.69,53.85 27.69,62.48 JP81.1
  other vias: 78.74,46.99
N$83  (via drill 0.3)
  Top 0.127: TP82.TP 80.26,48.01 33.91,48.01 27.94,53.98 27.94,63.63 25.78,65.79 23.88,65.79 JP82.1
  other vias: 81.28,46.99
N$84  (via drill 0.3)
  Top 0.127: TP83.TP 82.55,48.26 34.04,48.26 28.19,54.1 28.19,63.75 25.91,66.04 21.59,66.04 JP83.1
  other vias: 83.82,46.99
N$85  (via drill 0.3)
  Top 0.127: TP84.TP 84.84,48.51 34.16,48.51 28.45,54.23 28.45,63.88 26.04,66.29 19.3,66.29 JP84.1
  other vias: 86.36,46.99
N$86  (via drill 0.3)
  Top 0.127: TP85.TP 87.12,48.77 34.29,48.77 28.7,54.36 28.7,64.01 26.16,66.55 17.02,66.55 JP85.1
  other vias: 88.9,46.99
N$87  (via drill 0.3)
  Bottom 0.127: TP86.TP 90.68,47.75 33.78,47.75 27.69,53.85 27.69,62.48 26.67,63.5 13.97,63.5 JP86.1
  other vias: 91.44,46.99
N$88  (via drill 0.3)
  Bottom 0.127: TP87.TP 92.96,48.01 33.91,48.01 27.94,53.98 27.94,63.63 25.78,65.79 11.18,65.79 JP87.1
  other vias: 93.98,46.99
N$89  (via drill 0.3)
  Bottom 0.127: TP88.TP 95.25,48.26 34.04,48.26 28.19,54.1 28.19,63.75 25.91,66.04 8.89,66.04 JP88.1
  other vias: 96.52,46.99
N$90  (via drill 0.3)
  Bottom 0.127: TP89.TP 97.54,48.51 34.16,48.51 28.45,54.23 28.45,63.88 26.04,66.29 6.6,66.29 JP89.1
  other vias: 99.06,46.99
N$91  (via drill 0.3)
  Bottom 0.127: TP90.TP 99.82,48.77 34.29,48.77 28.7,54.36 28.7,64.01 26.16,66.55 4.32,66.55 JP90.1
  other vias: 101.6,46.99
N$92  (via drill 0.3)
  Top 0.127: TP91.TP 77.98,50.29 33.15,50.29 28.96,54.48 28.96,68.83 JP91.1
  other vias: 78.74,49.53
N$93  (via drill 0.3)
  Top 0.127: TP92.TP 80.26,50.55 33.27,50.55 29.21,54.61 29.21,69.98 25.78,73.41 23.88,73.41 JP92.1
  other vias: 81.28,49.53
N$94  (via drill 0.3)
  Top 0.127: TP93.TP 82.55,50.8 33.4,50.8 29.46,54.74 29.46,70.1 25.91,73.66 21.59,73.66 JP93.1
  other vias: 83.82,49.53
N$95  (via drill 0.3)
  Top 0.127: TP94.TP 84.84,51.05 33.53,51.05 29.72,54.86 29.72,70.23 26.04,73.91 19.3,73.91 JP94.1
  other vias: 86.36,49.53
N$96  (via drill 0.3)
  Top 0.127: TP95.TP 87.12,51.31 33.66,51.31 29.97,54.99 29.97,70.36 26.16,74.17 17.02,74.17 JP95.1
  other vias: 88.9,49.53
N$97  (via drill 0.3)
  Bottom 0.127: TP96.TP 90.68,50.29 33.15,50.29 28.96,54.48 28.96,68.83 26.67,71.12 13.97,71.12 JP96.1
  other vias: 91.44,49.53
N$98  (via drill 0.3)
  Bottom 0.127: TP97.TP 92.96,50.55 33.27,50.55 29.21,54.61 29.21,69.98 25.78,73.41 11.18,73.41 JP97.1
  other vias: 93.98,49.53
N$99  (via drill 0.3)
  Bottom 0.127: TP98.TP 95.25,50.8 33.4,50.8 29.46,54.74 29.46,70.1 25.91,73.66 8.89,73.66 JP98.1
  other vias: 96.52,49.53
N$100  (via drill 0.3)
  Bottom 0.127: TP99.TP 97.54,51.05 33.53,51.05 29.72,54.86 29.72,70.23 26.04,73.91 6.6,73.91 JP99.1
  other vias: 99.06,49.53
N$101  (via drill 0.3)
  Bottom 0.127: TP100.TP 99.82,51.31 33.66,51.31 29.97,54.99 29.97,70.36 26.16,74.17 4.32,74.17 JP100.1
  other vias: 101.6,49.53